# EAGLE design Power Distribution v2 (EAGLE 6.5.0)
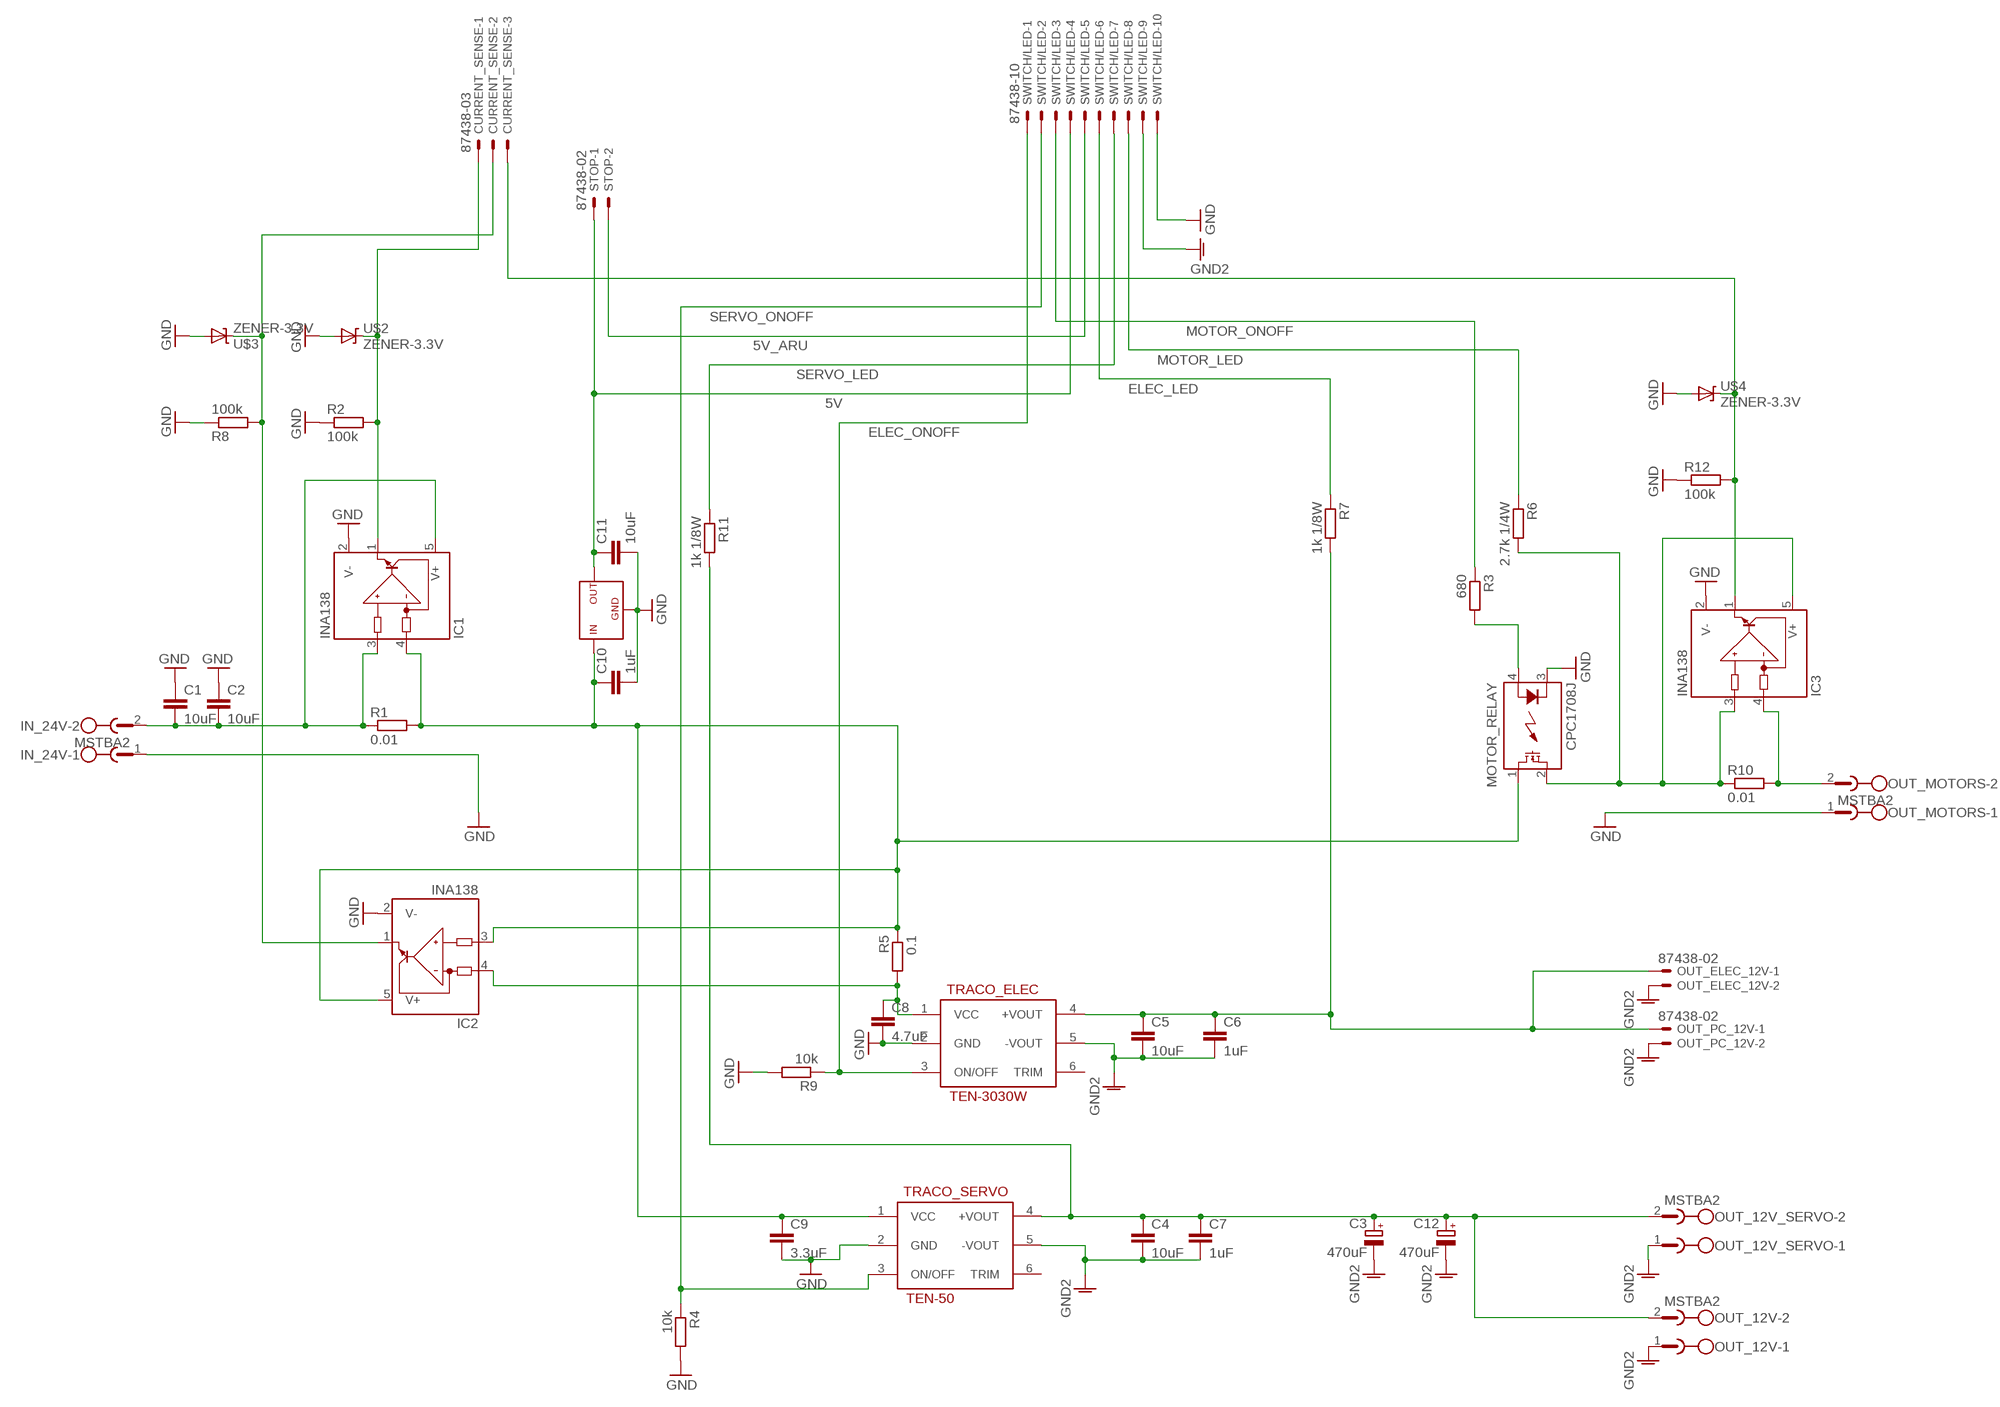
[diagram p0: schematic, sheet 1]

## Parts
C1  10uF  C-EUC1812  [C1812]
C2  10uF  C-EUC1812  [C1812]
C3  470uF  CPOL-EUE5-10.5  [E5-10,5]
C4  10uF  C-EUC1812  [C1812]
C5  10uF  C-EUC1812  [C1812]
C6  1uF  C-EUC0805  [C0805]
C7  1uF  C-EUC0805  [C0805]
C8  4.7uF  C-EUC1210  [C1210]
C9  3.3uF  C-EUC1210  [C1210]
C10  1uF  C-EUC0805  [C0805]
C11  10uF  C-EUC0805  [C0805]
C12  470uF  CPOL-EUE5-10.5  [E5-10,5]
CURRENT_SENSE  87438-03  [87438-03]
IC1  INA138  [SOT23-5]
IC2  INA138  [SOT23-5]
IC3  INA138  [SOT23-5]
IN_24V  MSTBA2  [MSTBA2]
MOTOR_RELAY  CPC1708J  [I4-PAC]
OUT_12V  MSTBA2  [MSTBA2]
OUT_12V_SERVO  MSTBA2  [MSTBA2]
OUT_ELEC_12V  87438-02  [87438-02]
OUT_MOTORS  MSTBA2  [MSTBA2]
OUT_PC_12V  87438-02  [87438-02]
R1  0.01  R-EU_R2010  [R2010]
R2  100k  R-EU_R0603  [R0603]
R3  680  R-EU_R0603  [R0603]
R4  10k  R-EU_R0603  [R0603]
R5  0.1  R-EU_R2010  [R2010]
R6  2.7k 1/4W  R-EU_R1206  [R1206]
R7  1k 1/8W  R-EU_R0603  [R0603]
R8  100k  R-EU_R0603  [R0603]
R9  10k  R-EU_R0603  [R0603]
R10  0.01  R-EU_R2010  [R2010]
R11  1k 1/8W  R-EU_R0603  [R0603]
R12  100k  R-EU_R0603  [R0603]
STOP  87438-02  [87438-02]
SWITCH/LED  87438-10  [87438-10]
TRACO_ELEC  TEN-3030W  [TRACO2X1]
TRACO_SERVO  TEN-50  TEN-3050W  [TRACO2X1_50W]
U$1  MIC5239  [SOT-223]
U$2  ZENER-3.3V  DIODE-ZENER-BZT52  [SOD-323]
U$3  ZENER-3.3V  DIODE-ZENER-BZT52  [SOD-323]
U$4  ZENER-3.3V  DIODE-ZENER-BZT52  [SOD-323]

## Nets
5V: C11.1 STOP.1 SWITCH/LED.4 U$1.3(OUT)
5V_ARU: STOP.2 SWITCH/LED.5
12V_ELEC: C5.1 C6.1 OUT_ELEC_12V.1 OUT_PC_12V.1 R7.2 TRACO_ELEC.4(+VOUT)
12V_MOTORS: IC3.3(IN+) IC3.5(V+) MOTOR_RELAY.2(DS2) R6.2 R10.1
12V_SERVO: C3.+ C4.1 C7.1 C12.+ OUT_12V.2 OUT_12V_SERVO.2 R11.2 TRACO_SERVO.4(+VOUT)
24VIN: C9.1 C10.1 IC1.4(IN-) IC2.3(IN+) IC2.5(V+) MOTOR_RELAY.1(DS1) R1.2 R5.1 TRACO_SERVO.1(VCC) U$1.1(IN)
AGND: C3.- C4.2 C5.2 C6.2 C7.2 C12.- OUT_12V.1 OUT_12V_SERVO.1 OUT_ELEC_12V.2 OUT_PC_12V.2 SWITCH/LED.9 TRACO_ELEC.5(-VOUT) TRACO_SERVO.5(-VOUT) ; supply symbol labelled GND2
ELEC_CURRENT: CURRENT_SENSE.2 IC2.1(OUT) R8.2 U$3.1(C)
ELEC_LED: R7.1 SWITCH/LED.6
ELEC_ONOFF: R9.1 SWITCH/LED.1 TRACO_ELEC.3(ON/OFF)
GND: C1.1 C2.1 C8.2 C9.2 C10.2 C11.2 IC1.2(V-) IC2.2(V-) IC3.2(V-) IN_24V.1 MOTOR_RELAY.3(K) OUT_MOTORS.1 R2.1 R4.2 R8.1 R9.2 R12.1 SWITCH/LED.10 TRACO_ELEC.2(GND) TRACO_SERVO.2(GND) U$1.2(GND) U$1.4(GND) U$2.2(A) U$3.2(A) U$4.2(A)
IN_CURRENT: CURRENT_SENSE.1 IC1.1(OUT) R2.2 U$2.1(C)
MOTOR_LED: R6.1 SWITCH/LED.8
MOTOR_ONOFF: R3.1 SWITCH/LED.3
MOTORS_CURRENT: CURRENT_SENSE.3 IC3.1(OUT) R12.2 U$4.1(C)
N$5: IC3.4(IN-) OUT_MOTORS.2 R10.2
N$6: C1.2 C2.2 IC1.3(IN+) IC1.5(V+) IN_24V.2 R1.1
N$7: C8.1 IC2.4(IN-) R5.2 TRACO_ELEC.1(VCC)
N$12: MOTOR_RELAY.4(A) R3.2
SERVO_LED: R11.1 SWITCH/LED.7
SERVO_ONOFF: R4.1 SWITCH/LED.2 TRACO_SERVO.3(ON/OFF)
Unconnected: TRACO_ELEC.6(TRIM) TRACO_SERVO.6(TRIM)

## Library data of the parts
C1 C2 C4-C11 = rcl:C-EU: CAPACITOR, European symbol
C3 C12 = rcl:CPOL-EU: POLARIZED CAPACITOR, European symbol
CURRENT_SENSE = con-molex:87438-03: Wire-to-Board 1.50mm (.059") Pitch Header - Right Angle, SMT, Shrouded Source: http://www.molex.com/product/micro/87438.html; OC_FARNELL: 1711328; OC_NEWARK: unknown
IC1-IC3 = burr-brown:INA138: High-Side Measurement Current Shunt Monitor; MF: TEXAS INSTRUMENTS; MPN: INA138NA/250; OC_FARNELL: 1564888; OC_NEWARK: 80K5906
IN_24V OUT_12V OUT_12V_SERVO OUT_MOTORS = con-phoenix-508:MSTBA2: PHOENIX; MF: FARNELL; MPN: 1757242; OC_FARNELL: 3705171; OC_NEWARK: 71C4161
MOTOR_RELAY = relay:CPC1708J: Single-Pole, Normally Open i4-PAC (TM) DC Power Relay Source: Data sheet <http://www.clare.com/home/pdfs.nsf/www/CPC1708.pdf/$file/CPC1708.pdf>
OUT_ELEC_12V OUT_PC_12V STOP = con-molex:87438-02: Wire-to-Board 1.50mm (.059") Pitch Header - Right Angle, SMT, Shrouded Source: http://www.molex.com/product/micro/87438.html; OC_FARNELL: 1711327; OC_NEWARK: unknown
R1-R12 = rcl:R-EU_: RESISTOR, European symbol
SWITCH/LED = con-molex:87438-10: Wire-to-Board 1.50mm (.059") Pitch Header - Right Angle, SMT, Shrouded Source: http://www.molex.com/product/micro/87438.html; OC_FARNELL: unknown; OC_NEWARK: unknown
TRACO_ELEC TRACO_SERVO = custom:TEN-30
U$1 = custom:MIC5239
U$2-U$4 = SparkFun:DIODE-ZENER: Zener Diode Production Part - 8199 3.4V Zener Voltage

## Board
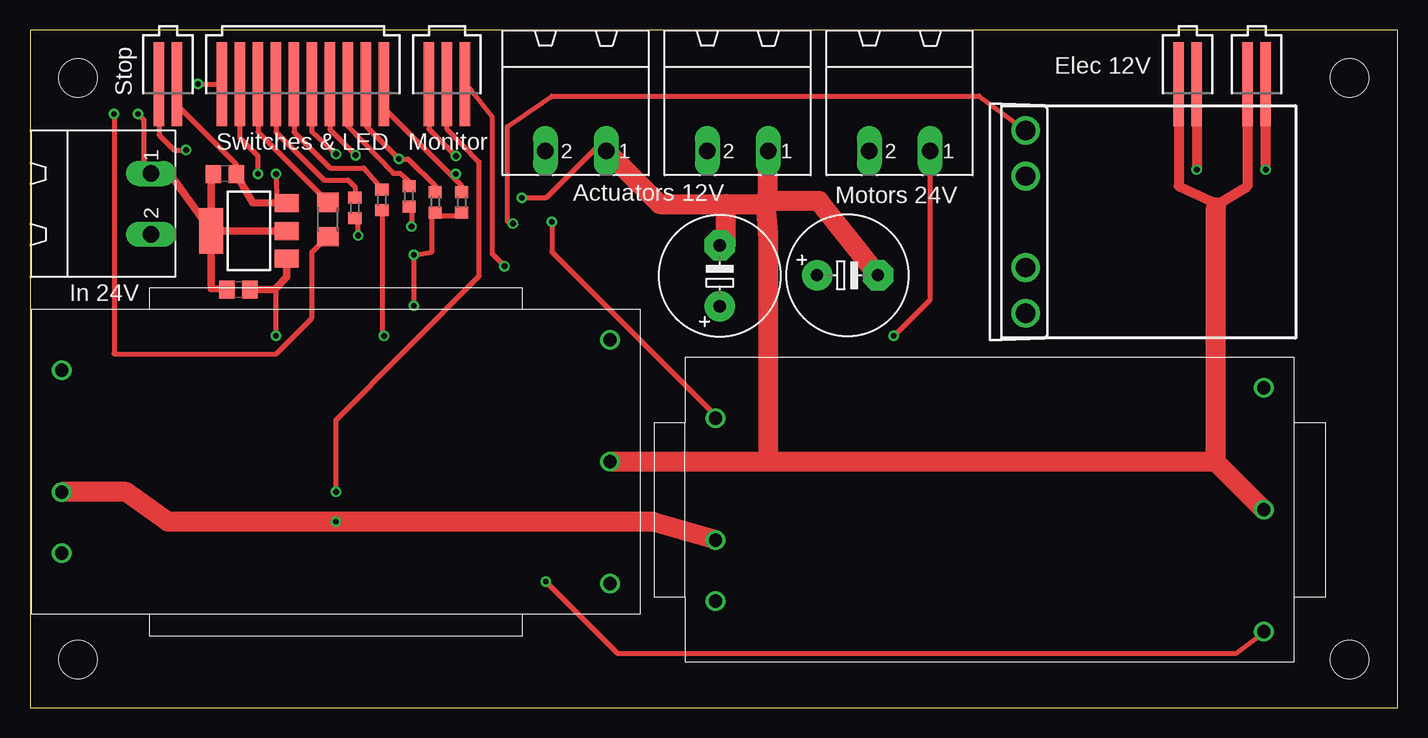
[diagram p1: board, top side]
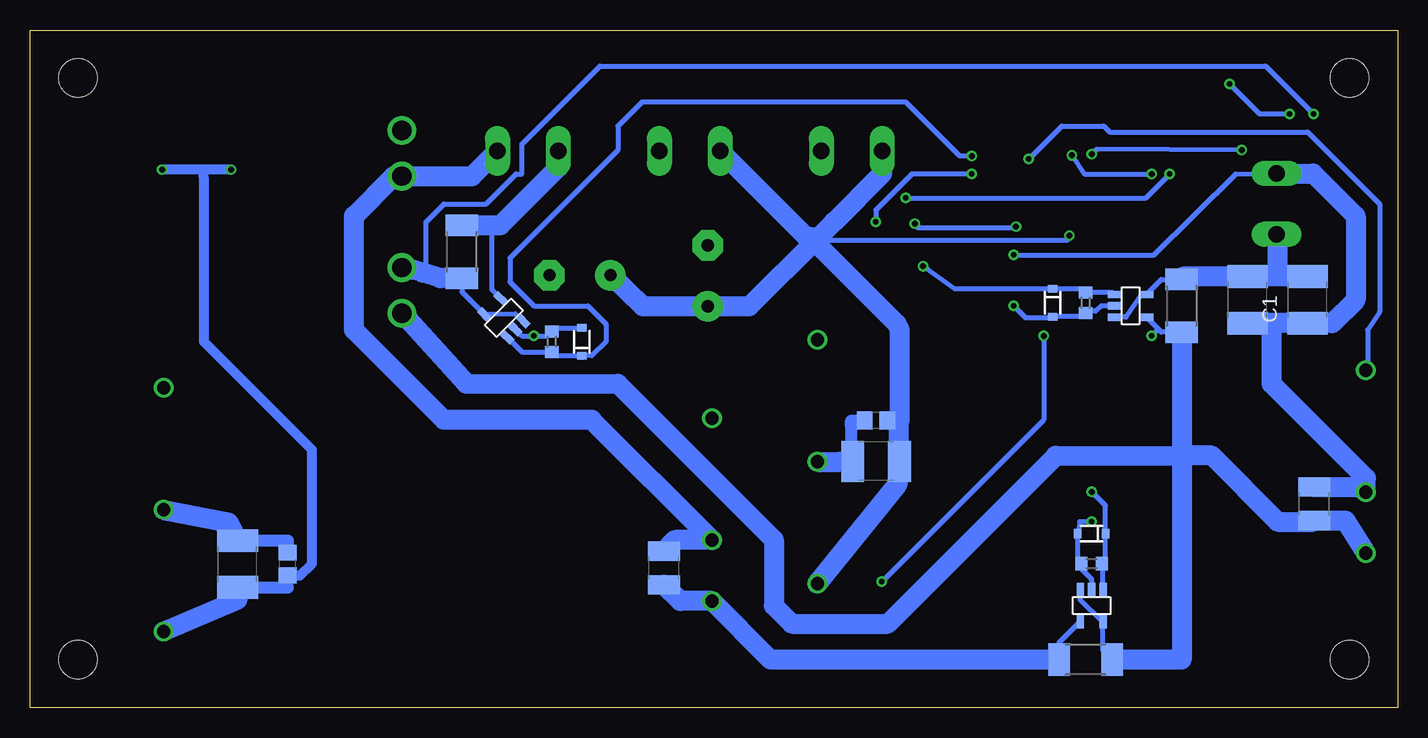
[diagram p2: board, bottom side, seen from below]

Size 114 x 56.5 mm. Coordinates in mm from the lower left corner, seen from the top.
Outline: 0,56.5 0,0 114,0 114,56.5 0,56.5
Copper layers (1*16): Top 0.0356mm / dielectric 1.5011mm / Bottom 0.0356mm
Design rules "Custom": minimum track width 16mil, minimum drill 19mil, track to track 16mil, track to pad 16mil, pad to pad 12mil, via to via 16mil, smd to smd 6mil, copper to edge 16mil, drill to drill 16mil, minimum pad ring 7mil, minimum via ring 7mil, stop-mask expansion 4mil, vias tented up to drill 0mil, thermal gap 10mil
Holes 3.2 mm at 110,4 4,52.5 110,52.5 4,4

### Footprints (pad centres in the part's own frame; a part is rotated, then mirrored left to right if it is on the bottom)
C1812 = smd 1.9 x 3.4: 1 -1.95,0; 2 1.95,0
E5-10,5 = drill 1.016 pad 2.54: + -2.54,0 | drill 1.016 pad 2.54 octagon: - 2.54,0
C0805 = smd 1.3 x 1.5: 1 -0.95,0; 2 0.95,0
C1210 = smd 1.6 x 2.7: 1 -1.4,0; 2 1.4,0
87438-03 = smd 7 x 0.85: 1 0,1.5; 2 0,0; 3 0,-1.5
SOT23-5 = smd 0.6 x 1.2: 1 -0.95,-1.306; 2 0,-1.306; 3 0.95,-1.306; 4 0.95,1.306; 5 -0.95,1.306
MSTBA2 = drill 1.397 long: 1 -2.54,5.08; 2 2.54,5.08
I4-PAC = drill 1.6 pad 2.3: 1 -7.62,0; 2 -3.81,0; 3 3.81,0; 4 7.62,0
87438-02 = smd 7 x 0.85: 1 0,0.75; 2 0,-0.75
R2010 = smd 1.8 x 2.7: 1 -2.2,0; 2 2.2,0
R0603 = smd 1 x 1.1: 1 -0.85,0; 2 0.85,0
R1206 = smd 1.6 x 1.803: 1 -1.422,0; 2 1.422,0
87438-10 = smd 7 x 0.85: 1 0,6.75; 2 0,5.25; 3 0,3.75; 4 0,2.25; 5 0,0.75; 6 0,-0.75; 7 0,-2.25; 8 0,-3.75; 9 0,-5.25; 10 0,-6.75
TRACO2X1 = drill 1.1: 1 -22.86,-7.62; 2 -22.86,-2.54; 3 -22.86,7.62; 4 22.86,-10.16; 5 22.86,0; 6 22.86,10.16
TRACO2X1_50W = drill 1.1: 1 -22.86,-7.62; 2 -22.86,-2.54; 3 -22.86,7.62; 4 22.86,-10.16; 5 22.86,0; 6 22.86,10.16
SOT-223 = smd 1.5 x 2: 1 -2.3,-3.15; 2 0,-3.15; 3 2.3,-3.15 | smd 3.8 x 2: 4 0,3.15
SOD-323 = smd 0.63 x 0.83: 1 -1.15,0; 2 1.15,0

### Placement (x,y rotation side)
C1  7.5,34 90 bottom
C2  12.5,34 90 bottom
C3  57.5,36 90 top
C4  43.47,20.53 180 bottom
C5  96.7,11.97 90 bottom
C6  92.51,11.97 90 bottom
C7  43.47,23.95 180 bottom
C8  61.15,11.64 90 bottom
C9  6.94,16.99 90 bottom
C10  17.38,34.84 180 top
C11  16.25,44.5 180 top
C12  68.15,36.05 0 top
CURRENT_SENSE  34.75,52 270 top
IC1  22.25,33.5 270 bottom
IC2  25.5,8.5 180 bottom
IC3  74.5,32.5 45 bottom
IN_24V  5,42 270 top
MOTOR_RELAY  83,40.5 90 top
OUT_12V  45.5,51.5 180 top
OUT_12V_SERVO  59,51.5 180 top
OUT_ELEC_12V  96.5,52 270 top
OUT_MOTORS  72.5,51.5 180 top
OUT_PC_12V  102.25,52 270 top
R1  18,33.5 270 bottom
R2  26,33.75 90 bottom
R3  31.6,42.62 270 top
R4  33.78,42.14 270 top
R5  26,4 180 bottom
R6  24.84,40.7 270 top
R7  29.34,42.33 270 top
R8  25.5,12 0 bottom
R9  35.99,42.14 270 top
R10  78,38 90 bottom
R11  27.09,41.67 270 top
R12  70.5,30.5 270 bottom
STOP  11.5,52 270 top
SWITCH/LED  22.75,52 270 top
TRACO_ELEC  80,16.5 0 top
TRACO_SERVO  25.5,20.5 0 top
U$1  18.25,39.75 90 top
U$2  28.75,33.75 270 bottom
U$3  25.5,14.5 180 bottom
U$4  68,30.5 90 bottom

### Tracks (layer width: path | path; a pad name or v marks a point on that pad's centre or on a via)
5V  (via drill 0.5)
  Top 0.406: C11.1 17.2,45.3 12.25,50.25 STOP.1 | SWITCH/LED.4 25,48.2 v27.15,46.05 | v20.5,44.5 20.55,42.05 18.55,42.1
  Top 0.61: U$1.3 18.55,42.1 C11.1
  Bottom 0.406: v27.15,46.05 26.1,44.5 v20.5,44.5
5V_ARU  (via drill 0.5)
  Top 0.406: STOP.2 10.75,47.75 12,46.5 v13,46.5 | v25.5,46.15 23.5,48 SWITCH/LED.5
  Bottom 0.406: v13,46.5 25.05,46.55 v25.5,46.15
12V_ELEC  (via drill 0.48, 0.5)
  Top 0.406: R7.2 29.34,31.16 v29.5,31 | v43,10.5 49,4.5 100.5,4.5 102.5,6 TRACO_ELEC.4
  Top 0.813: OUT_ELEC_12V.1 v97.25,44.85 | v103,44.85 OUT_PC_12V.1
  Bottom 0.406: v29.5,31 29.5,24 v43,10.5
  Bottom 0.813: C6.1 91.48,11.02 90.5,12 90.5,21.5 99.5,30.5 99.5,44 99.55,44.85 | v97.25,44.85 99.55,44.85 | 99.55,44.85 v103,44.85
  Bottom 1.016: C5.1 92.51,10.02 C6.1
  Bottom 1.676: TRACO_ELEC.4 96.7,9 C5.1
12V_MOTORS  (via drill 0.48)
  Top 0.406: v7,49.5 7,29.5 20.5,29.5 23.5,32.5 23.5,38 24.5,39 R6.2
  Bottom 0.406: R10.1 78,34.66 IC3.5 76.05,32.8 73.56,32.85 IC3.3 | v7,49.5 11,53.5 66.5,53.5 73,47 73,44.5 73.5,44.5 76,42 79.5,42 81,40.5 81,37 81.24,36.26
  Bottom 1.676: R10.1 79.8,35.8 81.24,36.26 82,36.5 82.81,36.5 MOTOR_RELAY.2
12V_SERVO  (via drill 0.48)
  Top 0.406: v27.35,39.35 27.35,40.5 R11.2
  Bottom 0.406: v27.35,39.35 27.5,39 47.5,39 47,40.5
  Bottom 1.016: 41.55,24.02 C7.1 41.5,23.95
  Bottom 1.676: TRACO_SERVO.4 41.66,18.65 C4.1 41.55,24.02 | C12.+ 62.92,33.46 C3.+ 54.04,33.46 48.25,39.25 | 48.25,39.25 47,40.5 42.96,44.54 OUT_12V.2 | OUT_12V_SERVO.2 49.29,39.25 49,39.25 | 49,39.25 48.25,39.25 | 41.5,23.95 41.5,31.5 41.75,32 49,39.25
24VIN  (via drill 0.48)
  Top 0.406: v20.5,31 20.5,35
  Top 0.61: C10.1 20.34,34.84 20.5,35 21.4,35.9 U$1.1
  Bottom 0.406: R5.1 24.55,4.75 IC2.5 24.64,7.19 26.45,8.95 IC2.3 | R1.2 19.69,31.3 19.95,31.55 | 19.95,31.55 IC1.4 | 19.95,31.55 v20.5,31
  Bottom 1.676: TRACO_SERVO.1 4.35,15.59 C9.1 7.03,15.5 9.99,15.5 15.5,21.01 18,21.01 | 18,21.01 18,4 R5.1 | MOTOR_RELAY.1 77.63,27.01 65,27 52,14 52,8.5 50.5,7 42.5,7 28.5,21 18,21.01 | R1.2 18,21.01
AGND  (via drill 0.48)
  Top 0.406: SWITCH/LED.9 17.5,47.5 19,46 v19,44.5 | v41,42.5 43,42.5 47.5,47 OUT_12V.1
  Top 0.813: OUT_ELEC_12V.2 95.75,43.5 99,42 | 99,42 101.5,43.5 OUT_PC_12V.2 | 98.86,41.69 arc-90 99,42
  Top 1.676: TRACO_ELEC.5 98.86,20.5 | 98.86,20.5 61.5,20.5 | 61.5,20.5 TRACO_SERVO.5 | OUT_12V.1 52.46,42 58,42 | 58,42 61,42 | 61,42 61.54,42.04 OUT_12V_SERVO.1 | 98.86,20.5 98.86,41.69 | 61,42 61.25,42.25 | 61.25,42.25 61.5,39.5 61.5,20.5 | C12.- 65.79,42.25 61.25,42.25 | C3.- 58,38.54 58,42
  Bottom 0.406: v19,44.5 21,42.5 v41,42.5
  Bottom 1.016: C5.2 92.51,13.92 C6.2 | C4.2 45.55,23.92 C7.2
  Bottom 1.676: TRACO_ELEC.5 97.44,15.42 C5.2 | TRACO_SERVO.5 46.55,20.5 C4.2
ELEC_CURRENT  (via drill 0.5)
  Top 0.406: v25.5,18 25.5,24 37.45,36 37.45,45.5 34.75,48.25 CURRENT_SENSE.2
  Bottom 0.406: IC2.1 24.55,11.9 R8.2 24.35,12.3 U$3.1 24.35,16.85 v25.5,18
ELEC_LED
  Top 0.406: SWITCH/LED.6 22,48 25,45 27.82,45 R7.1
ELEC_ONOFF  (via drill 0.48)
  Top 0.406: R9.1 35.99,43.51 35.5,44 | 35.5,44 29.5,50 SWITCH/LED.1 | v43.5,40.5 43.5,38 57,24.5 TRACO_ELEC.3 | 35.5,44 v35.5,44.5
  Bottom 0.406: v43.5,40.5 43.5,41.5 40.5,44.5 v35.5,44.5
GND  (via drill 0.48)
  Top 0.406: R9.2 36,41 34,41 R4.2 33.5,41.5 33.5,38 v32,37.75 v32,33.5 | v72,31 75,34 75,46 OUT_MOTORS.1 | v14,52 SWITCH/LED.10 | v9,49.5 9.5,49 9.5,45.5 10,45 IN_24V.1
  Top 0.61: U$1.2 U$1.4 | C10.2 15.1,34.92 U$1.4 | C11.2 15.1,43.8 U$1.4 | IN_24V.1 11.75,44.37 U$1.4
  Top 1.676: TRACO_ELEC.2 51.9,15.5 v25.5,15.5 11.5,15.5 8.04,17.96 TRACO_SERVO.2
  Bottom 0.406: IC2.2 25.5,10.7 26.35,11.55 R8.1 26.65,12.3 U$3.2 26.5,15.5 v25.5,15.5 | IC1.2 24.7,33.5 25.15,33.05 25.85,33.05 R2.1 26.3,32.6 U$2.2 29,32.5 31,32.5 v32,33.5 | IC3.2 73,31 v72,31 71,31 70.65,31.35 R12.1 70.2,31.65 U$4.2 | v32,37.75 20.3,37.75 13.5,44.5 IN_24V.1 | v14,52 11.5,49.5 v9,49.5
  Bottom 1.676: C9.2 3.21,18.39 TRACO_SERVO.2 2.64,19.14 10.5,27 10.5,32.05 | 10.5,32.05 C1.1 5.45,32.05 3.5,34 3.5,41 7.04,44.54 IN_24V.1 | 10.5,32.05 C2.1 | C8.2 60.23,13.96 TRACO_ELEC.2 67.18,24 79.5,24 87,31.5 87,41 83.69,44.31 MOTOR_RELAY.3 77.15,44.31 OUT_MOTORS.1
IN_CURRENT  (via drill 0.5)
  Top 0.406: CURRENT_SENSE.1 36.75,51.5 38.55,49.25 38.55,37.8 v39.55,36.8
  Bottom 0.406: IC1.1 23.71,34.6 R2.2 26.3,34.9 U$2.1 36.9,34.9 v39.55,36.8
MOTOR_LED
  Top 0.406: SWITCH/LED.8 19,48 24.34,42.66 R6.1
MOTOR_ONOFF
  Top 0.406: SWITCH/LED.3 26.5,48.45 30.25,44.55 30.87,44.55 31.5,44 R3.1
MOTORS_CURRENT  (via drill 0.5)
  Top 0.406: CURRENT_SENSE.3 33.25,48.25 v35.5,46
  Bottom 0.406: IC3.1 72.99,29.65 R12.2 70.2,29.35 U$4.1 67.15,29.35 66,30.5 66,32 67.5,33.5 72,33.5 74,35.5 74,37.5 65,46.5 65,48.5 63,50.5 41,50.5 36.5,46 v35.5,46
N$5
  Bottom 0.406: IC3.4 75.5,34.84 75.5,40.2
  Bottom 1.676: OUT_MOTORS.2 69.96,45.04 74.8,40.2 75.5,40.2 R10.2
N$6
  Bottom 0.406: R1.1 19.69,35.7 IC1.5 21.35,34.45 22.64,32.55 IC1.3
  Bottom 1.676: IN_24V.2 10,35.96 C1.2 C2.2 17.8,35.95 R1.1
N$7
  Bottom 0.406: R5.2 28.2,5.44 IC2.4
  Bottom 1.676: C8.1 59.79,8.88 TRACO_ELEC.1 52.26,4 R5.2
N$12  (via drill 0.5)
  Top 0.406: R3.2 31.8,41.57 v31.8,40.1 | v40.25,40.35 39.8,40.55 39.8,48.45 43.5,51 79.12,51 MOTOR_RELAY.4
  Bottom 0.406: v31.8,40.1 31.9,40 40,40 v40.25,40.35
SERVO_LED
  Top 0.406: SWITCH/LED.7 20.5,48 24.5,44 26.5,44 27.09,43.41 R11.1
SERVO_ONOFF  (via drill 0.48)
  Top 0.406: SWITCH/LED.2 28,48.5 v30.75,45.75 31.52,45.75 33.8,43.5 R4.1
  Bottom 0.406: v30.75,45.75 28,48.5 24.5,48.5 24,48 7.5,48 1.5,42 1.5,33 2.5,31.5 2.5,28.5 TRACO_SERVO.3

### Text on the board
tNames: Elec 12V | Stop | Switches & LED | Monitor | Actuators 12V | Motors 24V | In 24V